# EAGLE design bms (EAGLE 4.13)
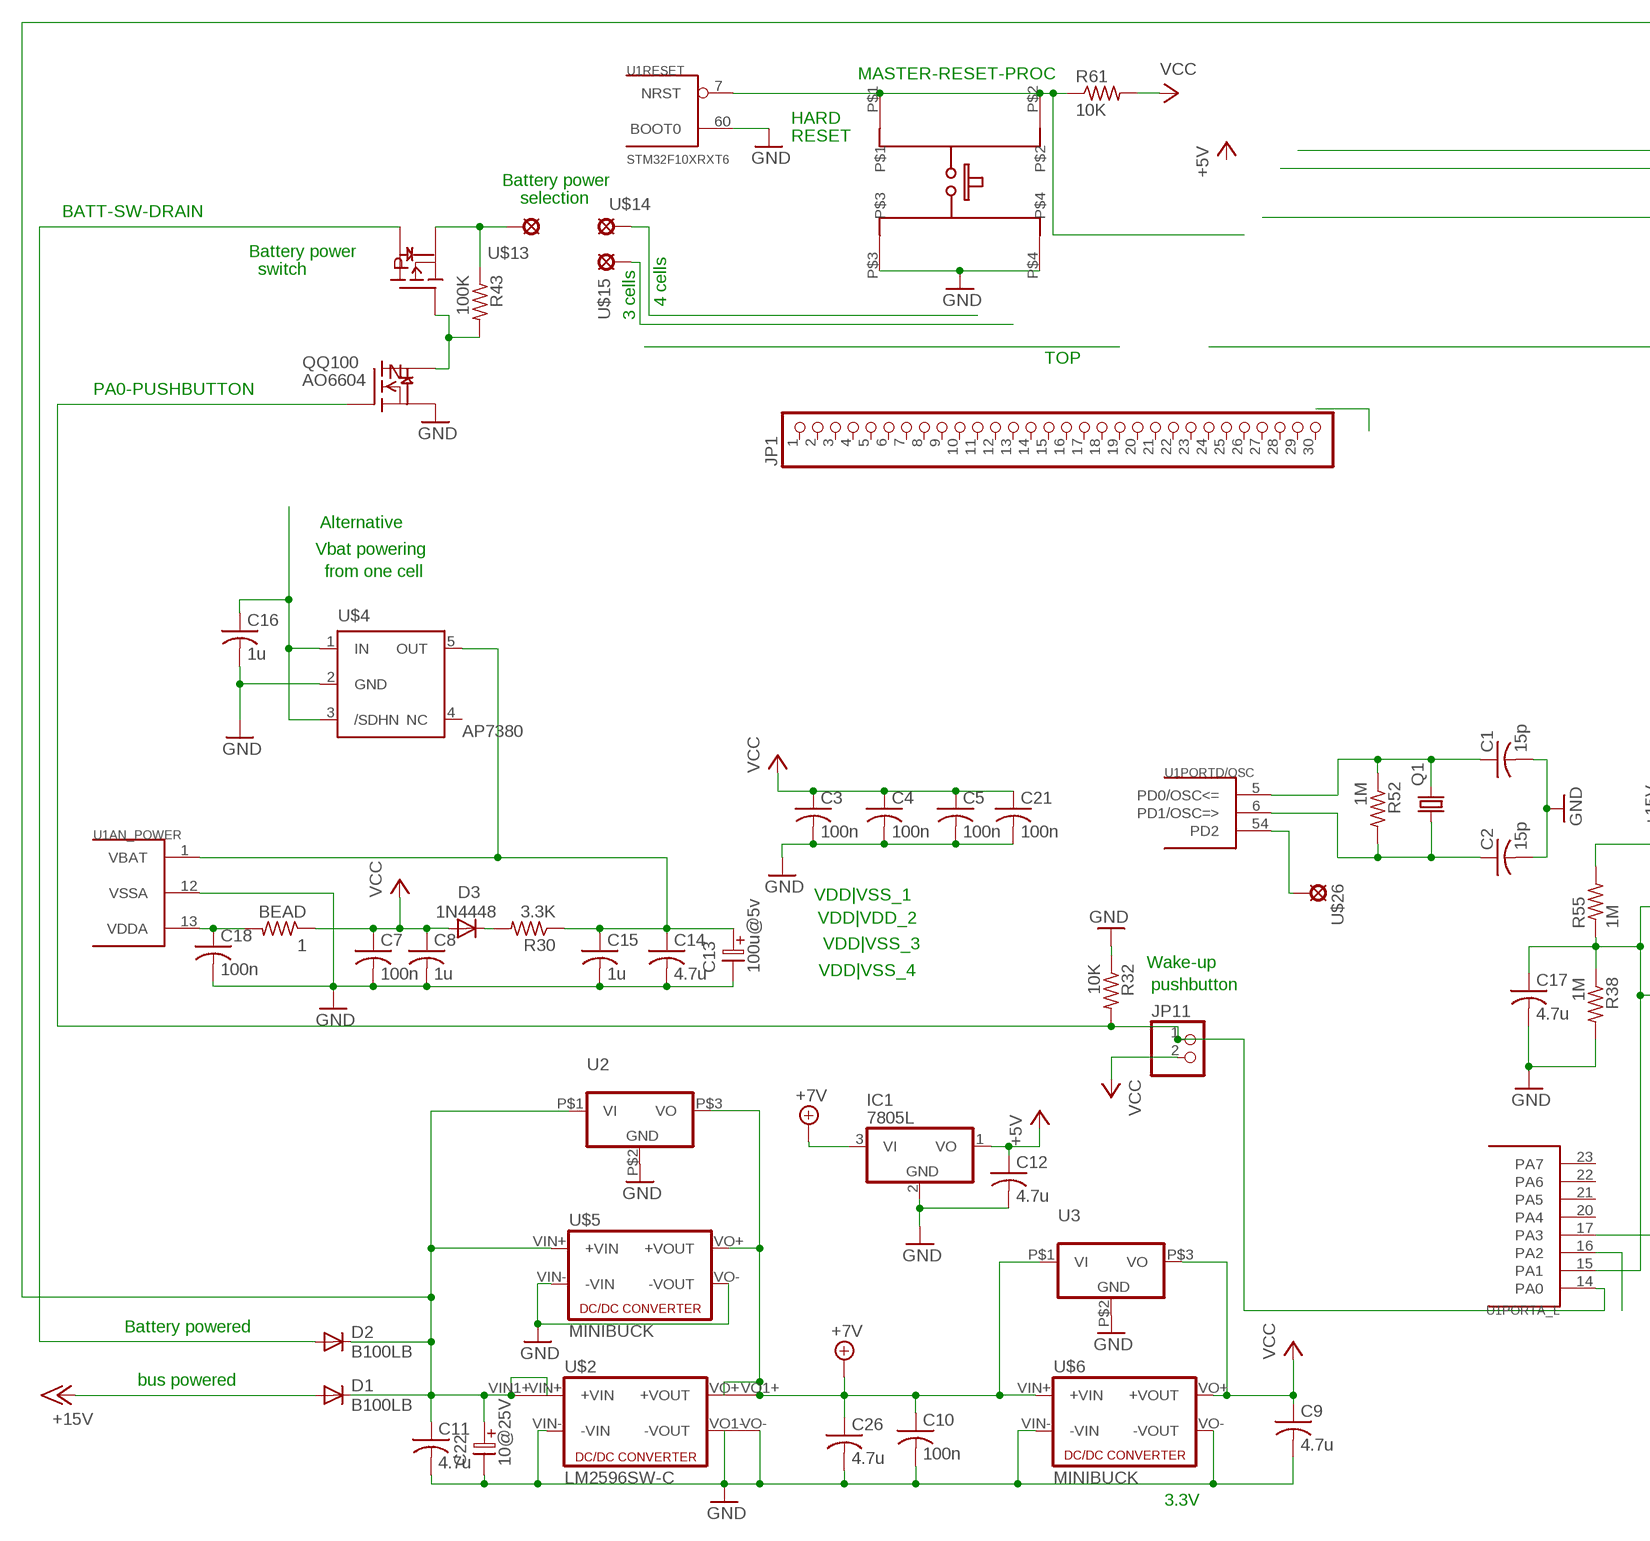
[diagram p0: schematic, sheet 1, part 1 of 2]
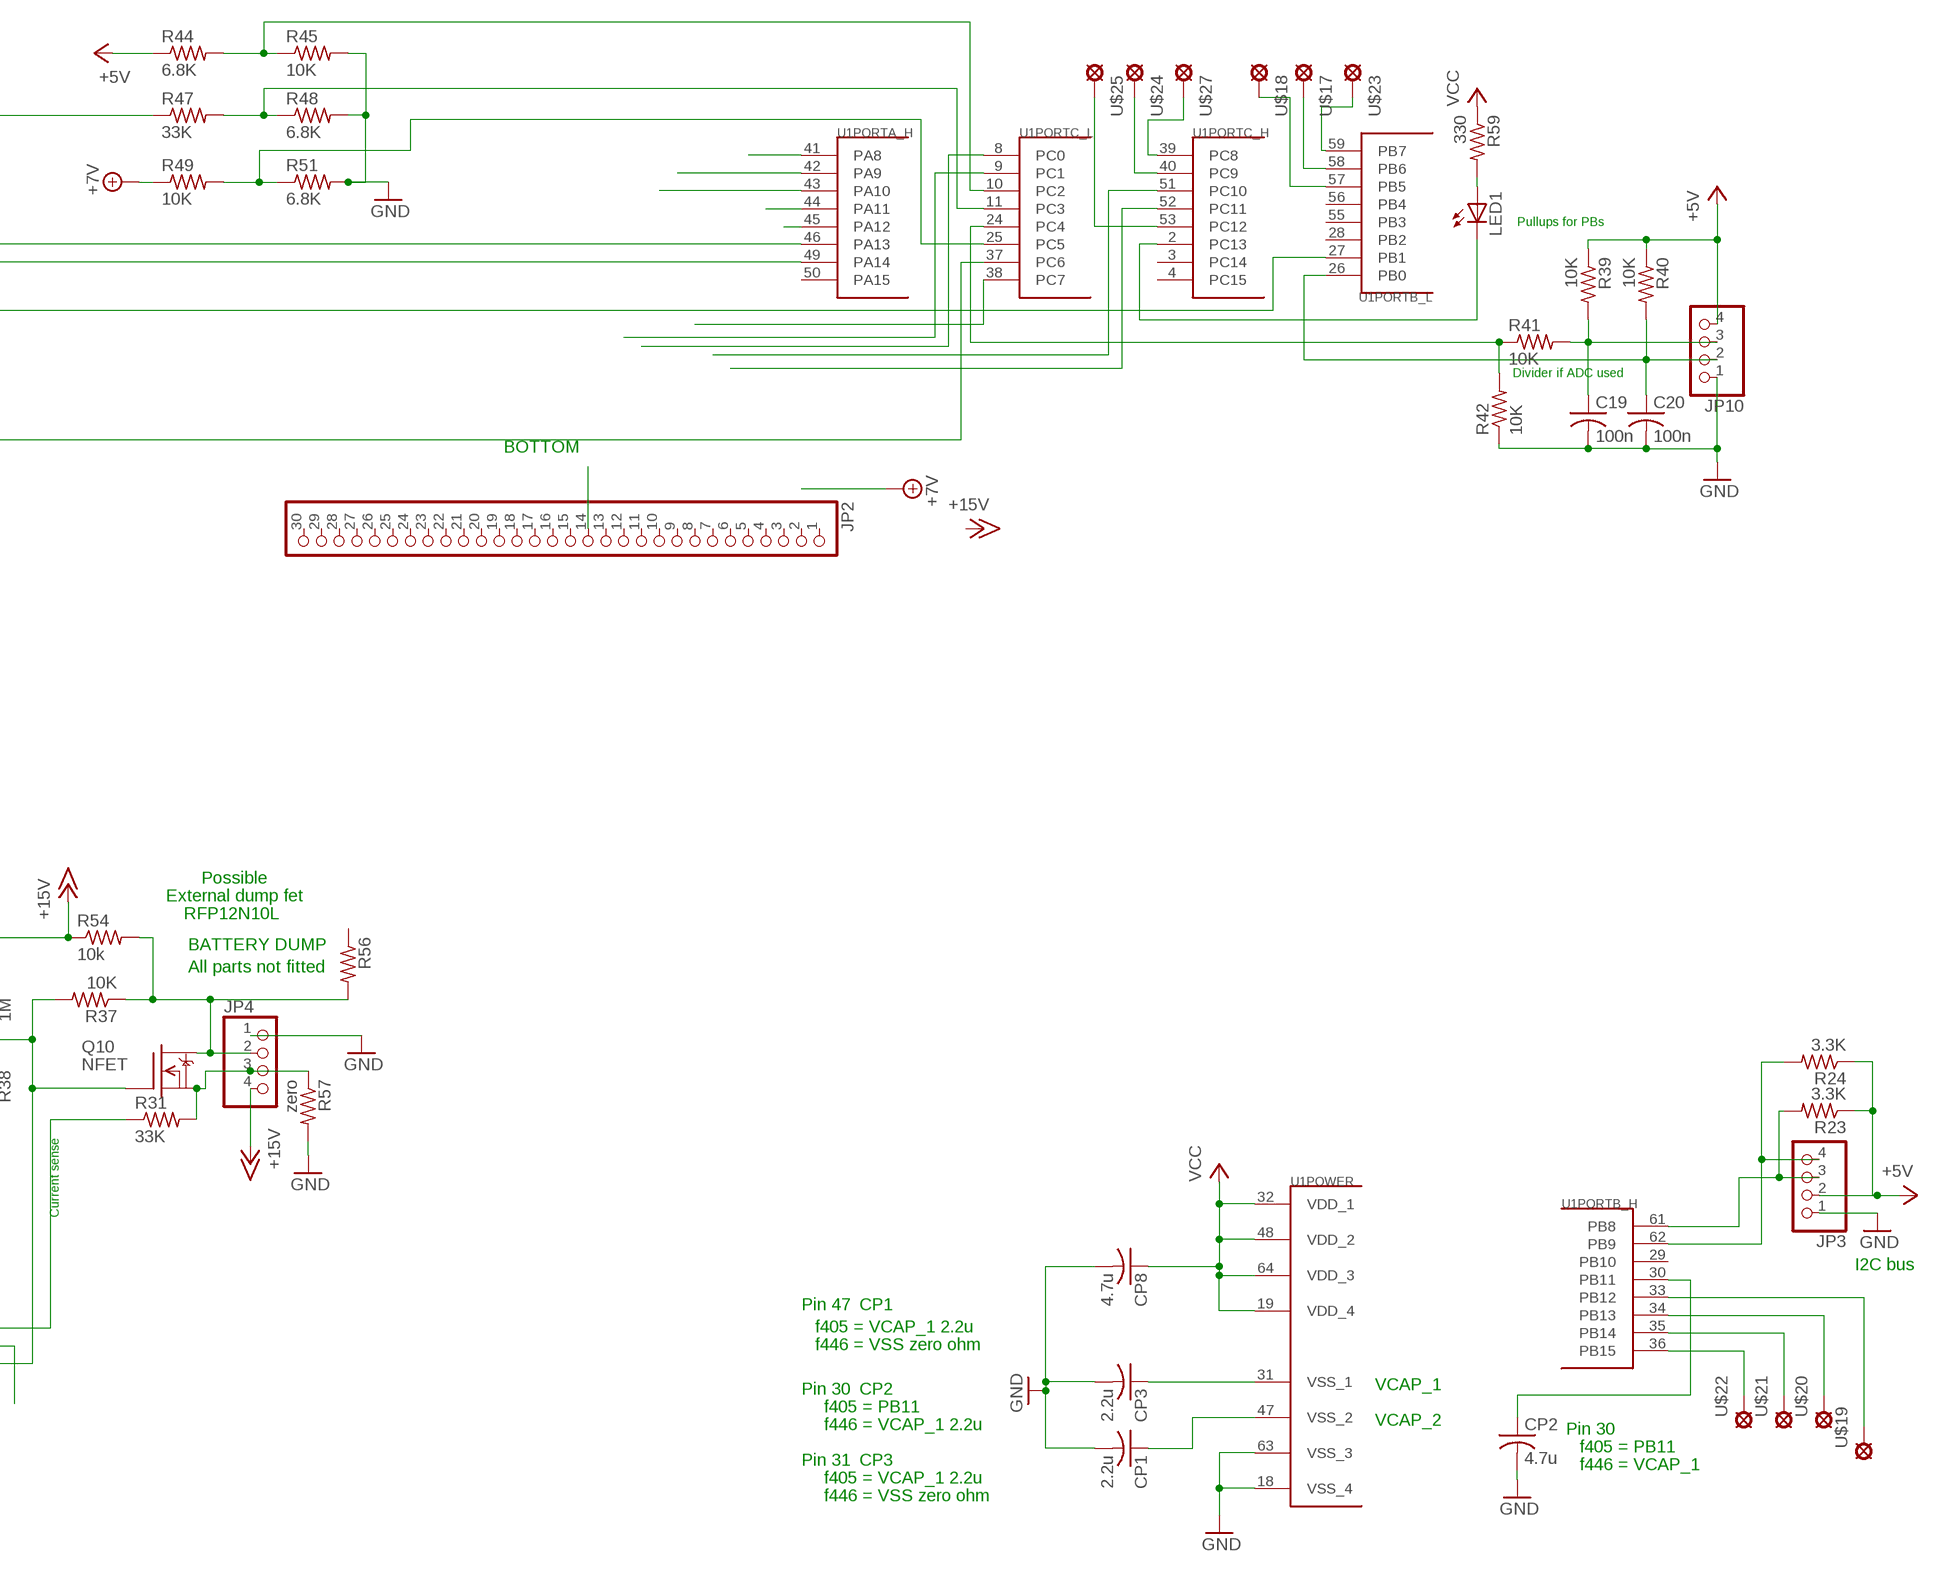
[diagram p1: schematic, sheet 1, part 2 of 2]

## Parts
BEAD  1  R-US_R0603  [R0603]
C1  15p  C-USC0603  [C0603]
C2  15p  C-USC0603  [C0603]
C3  100n  C-USC0603  [C0603]
C4  100n  C-USC0603  [C0603]
C5  100n  C-USC0603  [C0603]
C7  100n  C-USC0603  [C0603]
C8  1u  C-USC0603  [C0603]
C9  4.7u  C-USC0805  [C0805]
C10  100n  C-USC0603  [C0603]
C11  4.7u  C-USC0603  [C0603]
C12  4.7u  C-USC0805  [C0805]
C13  100u@5v  ELC-2,5L  [ES-2,5L]
C14  4.7u  C-USC0603  [C0603]
C15  1u  C-USC0603  [C0603]
C16  1u  C-USC0603  [C0603]
C17  4.7u  C-USC0603  [C0603]
C18  100n  C-USC0603  [C0603]
C19  100n  C-USC0603  [C0603]
C20  100n  C-USC0603  [C0603]
C21  100n  C-USC0603  [C0603]
C22  10@25V  ELC-2,5L  [ES-2,5L]
C26  4.7u  C-USC0603  [C0603]
CP1  2.2u  C-USC0603  [C0603]
CP2  4.7u  C-USC0603  [C0603]
CP3  2.2u  C-USC0603  [C0603]
CP8  4.7u  C-USC0603  [C0603]
D1  B100LB  [SMB_1]
D2  B100LB  [SMB_1]
D3  1N4448  DIODE-SOD123  [SOD123]
IC1  7805L  [TO92]
JP1  PINHD-1X30  [1X30]
JP2  PINHD-1X30  [1X30]
JP3  PINHD-1X4  [1X04]
JP4  PINHD-1X4  [1X04]
JP10  PINHD-1X4  [1X04]
JP11  PINHD-1X2  [1X02]
LED1  LEDCHIP-LED0603  [CHIP-LED0603]
Q1  CRYTALHC49S  [HC49/S]
Q10  NFET  DMN3404L  [SOT-23]
QQ100  AO6604  [TSOP6]
R23  3.3K  R-US_R0603  [R0603]
R24  3.3K  R-US_R0603  [R0603]
R30  3.3K  R-US_R0603  [R0603]
R31  33K  R-US_R0603  [R0603]
R32  10K  R-US_R0603  [R0603]
R37  10K  R-US_R0603  [R0603]
R38  1M  R-US_R0603  [R0603]
R39  10K  R-US_R0603  [R0603]
R40  10K  R-US_R0603  [R0603]
R41  10K  R-US_R0603  [R0603]
R42  10K  R-US_R0603  [R0603]
R43  100K  R-US_R0603  [R0603]
R44  6.8K  R-US_R0603  [R0603]
R45  10K  R-US_R0603  [R0603]
R47  33K  R-US_R0603  [R0603]
R48  6.8K  R-US_R0603  [R0603]
R49  10K  R-US_R0603  [R0603]
R51  6.8K  R-US_R0603  [R0603]
R52  1M  R-US_R0603  [R0603]
R54  10k  R-US_R0603  [R0603]
R55  1M  R-US_R0603  [R0603]
R56  R-US_0411/15  [0411/15]
R57  zero  R-US_R0603  [R0603]
R59  330  R-US_R0603  [R0603]
R61  10K  R-US_R0603  [R0603]
SW1  E-SWITCH  [E-SWITCH]
U1  STM32F10XRXT6  [TQFP64]
U2  78XXTVERT  [TO-220V1]
U3  78XXTVERT  [TO-220V1]
U$2  LM2596SW-C  [LM2596SW-C]
U$4  AP7380  MCP1811  [SOT23-5]
U$5  MINIBUCK  [MINIBUCK]
U$6  MINIBUCK  [MINIBUCK]
U$13  SOLDPAD028  [SOLPAD028]
U$14  SOLDPAD028  [SOLPAD028]
U$15  SOLDPAD028  [SOLPAD028]
U$17  SOLDPAD028  [SOLPAD028]
U$18  SOLDPAD028  [SOLPAD028]
U$19  SOLDPAD028  [SOLPAD028]
U$20  SOLDPAD028  [SOLPAD028]
U$21  SOLDPAD028  [SOLPAD028]
U$22  SOLDPAD028  [SOLPAD028]
U$23  SOLDPAD028  [SOLPAD028]
U$24  SOLDPAD028  [SOLPAD028]
U$25  SOLDPAD028  [SOLPAD028]
U$26  SOLDPAD028  [SOLPAD028]
U$27  SOLDPAD028  [SOLPAD028]

## Nets
15V-DIOIDE-ORED: C11.1 C22.1 D1.C D2.C R47.1 U2.P$1(VI) U$2.VIN1+(+VIN1) U$2.VIN+(+VIN) U$5.VIN+(+VIN)
+5V: C12.1 IC1.1(VO) JP3.2 JP10.4 R23.1 R24.1 R39.1 R40.1 R44.1
+7V: C10.1 C26.1 IC1.3(VI) R49.1 U2.P$3(VO) U3.P$1(VI) U$2.VO1+(+VOUT1) U$2.VO+(+VOUT) U$5.VO+(+VOUT) U$6.VIN+(+VIN)
+15V: D1.A JP4.4 R54.1 R55.2
BATT-SELECT: QQ100.P$2(S2) R43.1 U$13.MP
BATT-SW-DRAIN: D2.A QQ100.P$4(D2)
CL1: C16.1 U$4.1(IN) U$4.3(/SDHN)
CL3: U$15.MP
CL4: U$14.MP
DUAL-FET-BATT-SWITCH: QQ100.P$3(G2) QQ100.P$6(D1) R43.2
DUMPFETSOURCE: JP4.3 Q10.2(S) R31.2 R57.1
GND: C1.2 C2.2 C3.2 C4.2 C5.2 C7.2 C8.2 C9.2 C10.2 C11.2 C12.2 C13.2 C14.2 C15.2 C16.2 C17.2 C18.2 C19.2 C20.2 C21.2 C22.2 C26.2 CP1.2 CP2.2 CP3.2 CP8.2 IC1.2(GND) JP3.1 JP4.1 JP10.1 QQ100.P$5(S1) R32.1 R38.2 R42.1 R45.2 R48.2 R51.2 R57.2 SW1.P$3 SW1.P$4 U1.12(AN_POWER:VSSA) U1.18(POWER:VSS_4) U1.60(RESET:BOOT0) U1.63(POWER:VSS_3) U2.P$2(GND) U3.P$2(GND) U$2.VIN-(-VIN) U$2.VO1-(-VOUT) U$2.VO-(-VOUT1) U$4.2(GND) U$5.VIN-(-VIN) U$5.VO-(-VOUT) U$6.VIN-(-VIN) U$6.VO-(-VOUT)
JP12-FETDRAIN-RC: JP4.2 Q10.3(D) R37.1 R54.2 R56.2
JTCK: U1.49(PORTA_H:PA14)
JTMS: U1.46(PORTA_H:PA13)
LED1-A: LED1.A R59.2
N$1: U1.37(PORTC_L:PC6)
NRST: R61.1 SW1.P$1 SW1.P$2 U1.7(RESET:NRST)
PA0-PUSHBUTTON: JP11.1 QQ100.P$1(G1) R32.2 U1.14(PORTA_L:PA0)
PA1-DUMPFETGATE: C17.1 Q10.1(G) R37.2 R38.1 R55.1 U1.15(PORTA_L:PA1)
PA2|WDT: U1.16(PORTA_L:PA2)
PA3-DUMP-CURRENT: R31.1 U1.17(PORTA_L:PA3)
PA8-T1CH1-FANGATE: U1.41(PORTA_H:PA8)
PA9-USART1-TX: U1.42(PORTA_H:PA9)
PA10-USART1-RX: U1.43(PORTA_H:PA10)
PA11_CANRXD: U1.44(PORTA_H:PA11)
PA12_CANTX: U1.45(PORTA_H:PA12)
PB0: C20.1 JP10.2 R40.2 U1.26(PORTB_L:PB0)
PB1-T3C4-FANTACH: U1.27(PORTB_L:PB1)
PB5-CAN2-RX: U1.57(PORTB_L:PB5) U$18.MP
PB6-CAN2-TX: U1.58(PORTB_L:PB6) U$17.MP
PB7: U1.59(PORTB_L:PB7) U$23.MP
PB8-I2C2-SDA: JP3.3 R23.2 U1.61(PORTB_H:PB8)
PB9-I2C1-SCL: JP3.4 R24.2 U1.62(PORTB_H:PB9)
PB11-I2C2-SDA|VCAP1: CP2.1 U1.30(PORTB_H:PB11)
PB12-SPI2-NSS: U1.33(PORTB_H:PB12) U$19.MP
PB14-SPI2-MISO: U1.35(PORTB_H:PB14) U$21.MP
PB-13-SPI2-SCK: U1.34(PORTB_H:PB13) U$20.MP
PB-15-SPI2-MOSI: U1.36(PORTB_H:PB15) U$22.MP
PC0-15VDIVIDED-IN10: U1.8(PORTC_L:PC0)
PC1-BATDIVIDED-IN11: U1.9(PORTC_L:PC1)
PC2-IN12-5V-DIVIDED: R44.2 R45.1 U1.10(PORTC_L:PC2)
PC3-15V-OR-DIVIDED-IN13: R47.2 R48.1 U1.11(PORTC_L:PC3)
PC4-HEADER: C19.1 JP10.3 R39.2 R41.2
PC4-IN14: R41.1 R42.2 U1.24(PORTC_L:PC4)
PC5-7VDIVIDED-IN15: R49.2 R51.1 U1.25(PORTC_L:PC5)
PC7-T3C2-MCP1416-INPUT: U1.38(PORTC_L:PC7)
PC8-SDIO_D0: U1.39(PORTC_H:PC8) U$27.MP
PC9-SDIO_D1: U1.40(PORTC_H:PC9) U$24.MP
PC10-LED2: U1.51(PORTC_H:PC10)
PC11-LED1: U1.52(PORTC_H:PC11)
PC12-SDIO_CK|I2C2-SDA: U1.53(PORTC_H:PC12) U$25.MP
PC13-LED1: LED1.C U1.2(PORTC_H:PC13)
PD0_OSC_IN_XTAL: C1.1 Q1.2 R52.1 U1.5(PORTD/OSC:PD0/OSC<=)
PD1_OSC_OUT: C2.1 Q1.1 R52.2 U1.6(PORTD/OSC:PD1/OSC=>)
PD2-SDIO_CMD: U1.54(PORTD/OSC:PD2) U$26.MP
S18: JP2.14
VBAT: C13.1 C14.1 C15.1 R30.1 U1.1(AN_POWER:VBAT) U$4.5(OUT)
VBAT-DIODE-RES: D3.C R30.2
VCC: BEAD.1 C3.1 C4.1 C5.1 C7.1 C8.1 C9.1 C21.1 CP8.1 D3.A JP11.2 R59.1 R61.2 U1.19(POWER:VDD_4) U1.32(POWER:VDD_1) U1.48(POWER:VDD_2) U1.64(POWER:VDD_3) U3.P$3(VO) U$6.VO+(+VOUT)
VDDA: BEAD.2 C18.1 U1.13(AN_POWER:VDDA)
VSS_1-VCAP_1: CP3.1 U1.31(POWER:VSS_1)
VSS_2: CP1.1 U1.47(POWER:VSS_2)
Unconnected: JP1.1 JP1.2 JP1.3 JP1.4 JP1.5 JP1.6 JP1.7 JP1.8 JP1.9 JP1.10 JP1.11 JP1.12 JP1.13 JP1.14 JP1.15 JP1.16 JP1.17 JP1.18 JP1.19 JP1.20 JP1.21 JP1.22 JP1.23 JP1.24 JP1.25 JP1.26 JP1.27 JP1.28 JP1.29 JP1.30 JP2.1 JP2.2 JP2.3 JP2.4 JP2.5 JP2.6 JP2.7 JP2.8 JP2.9 JP2.10 JP2.11 JP2.12 JP2.13 JP2.15 JP2.16 JP2.17 JP2.18 JP2.19 JP2.20 JP2.21 JP2.22 JP2.23 JP2.24 JP2.25 JP2.26 JP2.27 JP2.28 JP2.29 JP2.30 R56.1 U1.3(PORTC_H:PC14) U1.4(PORTC_H:PC15) U1.20(PORTA_L:PA4) U1.21(PORTA_L:PA5) U1.22(PORTA_L:PA6) U1.23(PORTA_L:PA7) U1.28(PORTB_L:PB2) U1.29(PORTB_H:PB10) U1.50(PORTA_H:PA15) U1.55(PORTB_L:PB3) U1.56(PORTB_L:PB4) U$4.4(NC)

## Notes on the sheet
- MASTER-RESET-PROC
- HARD
- Pullups for PBs
- RESET
- Battery power
- selection
- BATT-SW-DRAIN
- Battery power
- switch
- Divider if ADC used
- 4 cells
- 3 cells
- TOP | BOTTOM
- PA0-PUSHBUTTON
- Alternative
- Vbat powering
- from one cell
- Possible
- External dump fet
- RFP12N10L
- BATTERY DUMP
- All parts not fitted
- VDD|VSS_1
- VDD|VDD_2
- VDD|VSS_3
- VDD|VSS_4 | Wake-up
- pushbutton
- Current sense
- I2C bus
- Pin 47 | CP1
- f405 = VCAP_1 2.2u
- f446 = VSS zero ohm
- Pin 30 | CP2 | VCAP_1
- f405 = PB11
- Battery powered | f446 = VCAP_1 2.2u | VCAP_2
- Pin 30
- f405 = PB11
- Pin 31 | CP3 | f446 = VCAP_1
- bus powered | f405 = VCAP_1 2.2u
- f446 = VSS zero ohm
- 3.3V

## Library data of the parts
BEAD R23 R24 R30-R32 R37-R45 R47-R49 R51 R52 R54-R57 R59 R61 = rcl:R-US_: RESISTOR, American symbol
C1-C5 C7-C12 C14-C21 C26 CP1-CP3 CP8 = rcl:C-US: CAPACITOR, American symbol
C13 C22 = DEH:ELC-2,5L
D1 D2 = diode-1:B100LB
D3 = diode:DIODE-: DIODE
IC1 = linear:78*: Positive VOLTAGE REGULATOR
JP1 JP2 = pinhead:PINHD-1X30: PIN HEADER
JP3 JP4 JP10 = pinhead:PINHD-1X4: PIN HEADER
JP11 = pinhead:PINHD-1X2: PIN HEADER
LED1 = led:LED: LED OSRAM: - CHIPLED LG R971, LG N971, LY N971, LG Q971, LY Q971, LO R971, LY R971 LH N974, LH R974 LS Q976, LO Q976, LY Q976 LO Q996 - Hyper CHIPLED LW Q18S LB Q993, LB Q99A, LB R99A - SideLED LS A670, LO A670, LY A670, LG A670, LP A670 LB A673, LV A673, LT A673, LW A673 LH A674 LY A675 LS A676, LA A676, LO A676, LY A676, LW A676 LS A679, LY A679, LG A679 - Hyper Micro SIDELED® LS Y876, LA Y876, LO Y876, LY Y876 LT Y87S - SmartLED LW L88C, LW L88S LB L89C, LB L89S, LG L890 LS L89K, LO L89K, LY L89K LS L896, LA L896, LO L896, LY L896 - TOPLED LS T670, LO T670, LY T670, LG T670, LP T670 LSG T670, LSP T670, LSY T670, LOP T670, LYG T670 LG T671, LOG T671, LSG T671 LB T673, LV T673, LT T673, LW T673 LH T674 LS T676, LA T676, LO T676, LY T676, LB T676, LH T676, LSB T676, LW T676 LB T67C, LV T67C, LT T67C, LS T67K, LO T67K, LY T67K, LW E67C LS E67B, LA E67B, LO E67B, LY E67B, LB E67C, LV E67C, LT E67C LW T67C LS T679, LY T679, LG T679 LS T770, LO T770, LY T770, LG T770, LP T770 LB T773, LV T773, LT T773, LW T773 LH T774 LS E675, LA E675, LY E675, LS T675 LS T776, LA T776, LO T776, LY T776, LB T776 LHGB T686 LT T68C, LB T68C - Hyper Mini TOPLED® LB M676 - Mini TOPLED Santana® LG M470 LS M47K, LO M47K, LY M47K Source: http://www.osram.convergy.de/
Q1 = crystal:CRYTAL: CRYSTAL
Q10 = transistor-fet:DMN3404L
QQ100 = transistor-fet:AO6604
SW1 = switch-misc:E-SWITCH
U1 = stm32:STM32F10XRXT6: STM32F101/103 64pin LQFP
U2 U3 = DEH:78XXTVERT
U$2 = dc-dc-converter:LM2596SW-C
U$4 = v-reg-2:MCP1811
U$5 U$6 = dc-dc-converter:MINIBUCK
U$13-U$15 U$17-U$27 = solpad:SOLDPAD028

## Board
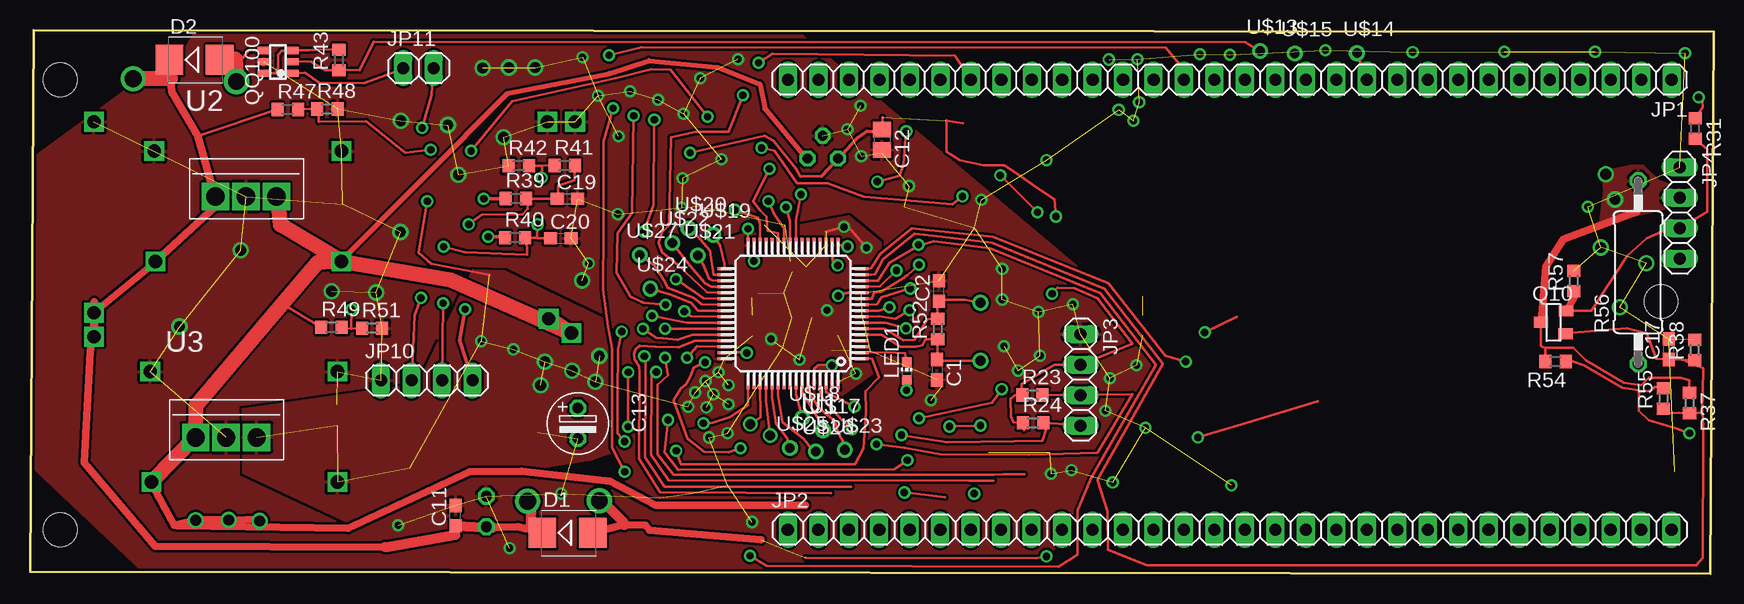
[diagram p2: board, top side]
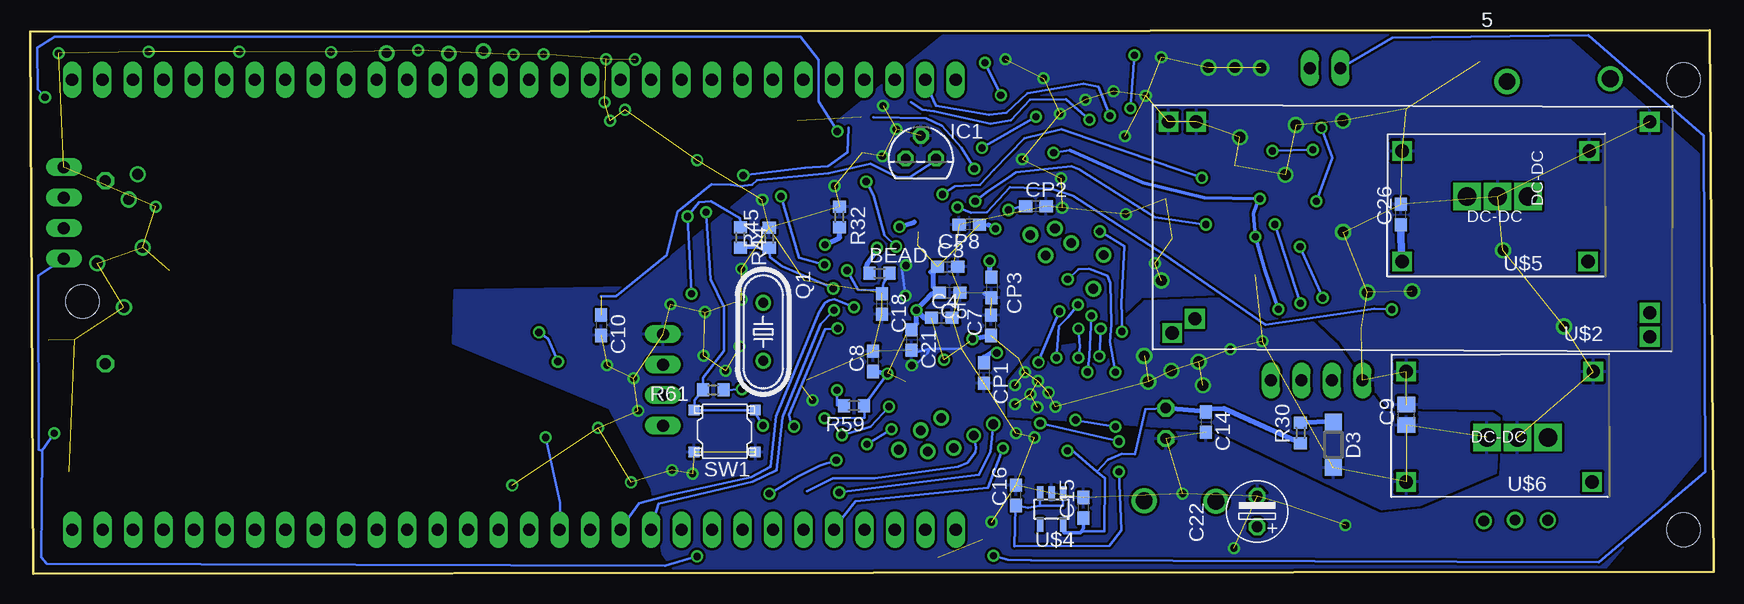
[diagram p3: board, bottom side, seen from below]

Size 140.34 x 45.31 mm. Coordinates in mm from the lower left corner, seen from the top.
Outline: 0,0.18 0.31,45.31 140.34,45.17 140.06,0 0,0.18
Copper layers (1*16): Top 0.035mm / dielectric 1.5mm / Bottom 0.035mm
Design rules "default": minimum track width 8mil, minimum drill 0.6mm, track to track 0.2083mm, track to pad 8mil, pad to pad 8mil, via to via 8mil, smd to smd 0mil, copper to edge 8mil, drill to drill 8mil, minimum pad ring 10mil, minimum via ring 8mil, stop-mask expansion 4mil, vias tented up to drill 0mil, thermal gap 10mil
Holes 2.8 mm at 135.96,22.68 2.51,41.16 2.51,3.67

### Footprints (pad centres in the part's own frame; a part is rotated, then mirrored left to right if it is on the bottom)
R0603 = smd 1 x 1.1: 1 -0.85,0; 2 0.85,0
C0603 = smd 1.1 x 1: 1 -0.85,0; 2 0.85,0
C0805 = smd 1.3 x 1.5: 1 -0.85,0; 2 0.85,0
ES-2,5L = drill 0.889 pad 1.27 octagon: 1 0,0; 2 2.54,0
SMB_1 = smd 2.3 x 2.5: A 1.9,0; C -2.3,0
SOD123 = smd 1.4 x 1.4: A 1.9,0; C -1.9,0
TO92 = drill 0.813 octagon: 1 -1.27,0; 2 0,1.905; 3 1.27,0
1X30 = drill 1.016 long: 1 -36.83,0; 2 -34.29,0; 3 -31.75,0; 4 -29.21,0; 5 -26.67,0; 6 -24.13,0; 7 -21.59,0; 8 -19.05,0; 9 -16.51,0; 10 -13.97,0; 11 -11.43,0; 12 -8.89,0; 13 -6.35,0; 14 -3.81,0; 15 -1.27,0; 16 1.27,0; 17 3.81,0; 18 6.35,0; 19 8.89,0; 20 11.43,0; 21 13.97,0; 22 16.51,0; 23 19.05,0; 24 21.59,0; 25 24.13,0; 26 26.67,0; 27 29.21,0; 28 31.75,0; 29 34.29,0; 30 36.83,0
1X04 = drill 1 long: 1 -3.81,0; 2 -1.27,0; 3 1.27,0; 4 3.81,0
1X02 = drill 1 long: 1 -1.27,0; 2 1.27,0
CHIP-LED0603 = smd 0.8 x 0.8: A 0,-0.75; C 0,0.75
HC49/S = drill 0.813 round: 1 -2.413,0; 2 2.413,0
SOT-23 = smd 0.9 x 1.2: 1 -1,-1.006; 2 0.9,-1.056; 3 -0.05,1.056
TSOP6 = smd 0.6 x 1: P$1 -0.95,-1.2; P$2 0,-1.2; P$3 0.95,-1.2; P$4 0.95,1.2; P$5 0,1.2; P$6 -0.95,1.2
0411/15 = drill 0.914 octagon: 1 -7.62,0; 2 7.62,0
E-SWITCH = smd 0.9 x 0.9: P$1 -2.55,1.75; P$2 2.55,1.75; P$3 -2.55,-1.75; P$4 2.55,-1.75
TQFP64 = smd 1.2 x 0.26: 1 -5.7,3.75; 2 -5.7,3.25; 3 -5.7,2.75; 4 -5.7,2.25; 5 -5.7,1.75; 6 -5.7,1.25; 7 -5.7,0.75; 8 -5.7,0.25; 9 -5.7,-0.25; 10 -5.7,-0.75; 11 -5.7,-1.25; 12 -5.7,-1.75; 13 -5.7,-2.25; 14 -5.7,-2.75; 15 -5.7,-3.25; 16 -5.7,-3.75; 33 5.7,-3.75; 34 5.7,-3.25; 35 5.7,-2.75; 36 5.7,-2.25; 37 5.7,-1.75; 38 5.7,-1.25; 39 5.7,-0.75; 40 5.7,-0.25; 41 5.7,0.25; 42 5.7,0.75; 43 5.7,1.25; 44 5.7,1.75; 45 5.7,2.25; 46 5.7,2.75; 47 5.7,3.25; 48 5.7,3.75 | smd 0.26 x 1.2: 17 -3.75,-5.7; 18 -3.25,-5.7; 19 -2.75,-5.7; 20 -2.25,-5.7; 21 -1.75,-5.7; 22 -1.25,-5.7; 23 -0.75,-5.7; 24 -0.25,-5.7; 25 0.25,-5.7; 26 0.75,-5.7; 27 1.25,-5.7; 28 1.75,-5.7; 29 2.25,-5.7; 30 2.75,-5.7; 31 3.25,-5.7; 32 3.75,-5.7; 49 3.75,5.7; 50 3.25,5.7; 51 2.75,5.7; 52 2.25,5.7; 53 1.75,5.7; 54 1.25,5.7; 55 0.75,5.7; 56 0.25,5.7; 57 -0.25,5.7; 58 -0.75,5.7; 59 -1.25,5.7; 60 -1.75,5.7; 61 -2.25,5.7; 62 -2.75,5.7; 63 -3.25,5.7; 64 -3.75,5.7
TO-220V1 = drill 1.524 pad 2.184 square: P$1 -2.54,-1.905; P$2 0,-1.905; P$3 2.54,-1.905
LM2596SW-C = drill 1.1 square: VIN1+ -19,9.7; VIN+ -19,7.7; VIN- -19,-8.2; VO1+ 20.8,9.4; VO1- 21.1,-8.2; VO+ 18.9,8.2; VO- 18.8,-8.2
SOT23-5 = smd 0.55 x 1.2: 1 -0.95,-1.3; 2 0,-1.3; 3 0.95,-1.3; 4 0.95,1.3; 5 -0.95,1.3
MINIBUCK = drill 1.1 square: VIN+ -7.7,4.6; VIN- -7.8,-4.6; VO+ 7.8,4.6; VO- 7.8,-4.6
SOLPAD028 = drill 0.8 pad 1.1 round: MP 0,0

### Placement (x,y rotation side)
BEAD  69.53,25.03 0 bottom
C1  75.6,17 270 top
C2  75.77,23.56 90 top
C3  63.85,25.57 0 bottom
C4  64.33,21.33 0 bottom
C5  63.68,23.42 0 bottom
C7  60.22,20.7 90 bottom
C8  70.05,17.7 90 bottom
C9  25.6,13.24 90 bottom
C10  92.73,20.71 270 bottom
C11  35.47,4.84 90 top
C12  71.02,36.17 270 top
C13  45.66,13.8 270 top
C14  42.33,12.63 270 bottom
C15  52.52,5.5 90 bottom
C16  58.15,6.53 90 bottom
C17  136.62,18.71 90 top
C18  69.34,22.47 270 bottom
C19  44.8,31.25 0 top
C20  44.25,27.96 0 top
C21  66.85,19.48 270 bottom
C22  38.04,3.91 90 bottom
C26  26.06,29.93 90 bottom
CP1  60.83,16.73 270 bottom
CP2  56.49,30.63 0 bottom
CP3  60.18,23.86 270 bottom
CP8  62.04,29.1 180 bottom
D1  45.01,3.4 0 top
D2  13.91,42.83 0 top
D3  31.69,10.75 270 bottom
IC1  66.08,34.6 0 bottom
JP1  100.01,41.17 180 top
JP2  100,3.67 0 top
JP3  87.58,16.16 270 top
JP4  137.52,30.07 270 top
JP10  33.08,16.11 0 top
JP11  32.38,42.14 0 top
LED1  73.07,16.88 0 top
Q1  79.22,20.16 270 bottom
Q10  126.99,21 90 top
QQ100  20.68,42.66 90 top
R23  83.56,14.89 0 top
R24  83.61,12.57 0 top
R30  34.44,11.74 90 bottom
R31  138.81,37.1 270 top
R32  72.87,29.74 270 bottom
R37  138.33,14.23 270 top
R38  138.76,18.66 90 top
R39  40.51,31.27 0 top
R40  40.44,28.01 0 top
R41  44.57,34.02 0 top
R42  40.74,34 0 top
R43  25.75,42.8 90 top
R44  81.12,28.02 270 bottom
R45  78.72,28 90 bottom
R47  21.49,38.69 0 top
R48  24.78,38.73 0 top
R49  25.14,20.54 0 top
R51  28.52,20.46 0 top
R52  75.67,20.39 90 top
R54  127.15,17.68 180 top
R55  136.15,14.59 90 top
R56  134.05,25.12 90 top
R57  128.68,24.4 90 top
R59  71.65,14 180 bottom
R61  83.38,15.32 0 bottom
SW1  82.43,11.89 0 bottom
U1  63.61,21.68 180 top
U2  18,33.34 0 top
U3  16.35,13.26 0 top
U$2  24.33,29.46 180 bottom
U$4  55.18,5.39 180 bottom
U$5  18.16,30.62 180 bottom
U$6  17.83,12.25 180 bottom
U$13  102.54,43.56 0 top
U$14  110.61,43.38 0 top
U$15  105.43,43.36 0 top
U$17  66.1,11.95 0 top
U$18  64.38,12.98 0 top
U$19  56.95,28.24 0 top
U$20  54.9,28.77 0 top
U$21  55.67,26.51 0 top
U$22  53.54,27.57 0 top
U$23  67.92,10.33 0 top
U$24  51.7,23.75 0 top
U$25  63.35,10.48 0 top
U$26  65.5,10.19 0 top
U$27  50.84,26.57 0 top

### Tracks (layer width: path | path; a pad name or v marks a point on that pad's centre or on a via)
15V-DIOIDE-ORED  (via drill 1.4)
  Top 0.203: 39.19,3.88 39.19,3.86 C22.1 | D1.C 41.91,3.99 40.64,3.99 40.64,3.9 | 13.99,36.48 14.06,36.49 R47.1
  Top 0.406: v41.48,6.05 v41.48,6.04 41.82,6.01
  Top 0.61: U2.P$1 15.45,31.54 | U2.P$1 | U2.P$1 15.45,30.58 15.42,30.58 U$5.VIN+ 10.37,25.89 U$2.VIN+ 5.35,22.65 U$2.VIN1+ 5.39,20.76 5.04,18.54 4.51,9.24 10.42,2.27 29.6,2.21 | U2.P$1 15.42,31.43 | 41.33,3.74 40.69,3.9 40.64,3.9 39.19,3.88 38.69,3.87 | D1.C 41.73,3.75 | D2.C 11.72,41.27 11.8,40.18 13.99,36.48 15.43,31.39 U2.P$1
  Top 0.813: 29.6,2.21 35.44,3.24 35.47,3.95 C11.1 38.6,3.85 C22.1 | 41.73,3.75 41.76,3.88 41.82,6.01
  Top 1.27: 11.72,41.27 11.41,41.25 v8.6,41.25
+5V  (via drill 0.6)  (1 unrouted)
  Top 0.203: 77.79,37.56 76.38,37.76 76.38,37.78 76.4,35.16 77.5,34.47 79.48,34.04 81.23,34.05 82.63,33.08 83.5,32.47 84.43,31.84 85.41,31.19 v85.52,29.77 | 70.99,36.85 C12.1 71.06,38.02 | 65.98,33.12 64.23,33.12 64.23,33.1 63.85,33.75 61.98,36.07 61.21,36.51 v55.01,35.09 | 67.11,34.33 IC1.1 67.64,34.89 | 39.72,31.23 R39.1 | 39.53,28.07 R40.1 | 82.84,11.96 R24.1 81.97,12.63 81.77,13.11 81.74,14.59 82.11,14.88 82.67,14.92 R23.1 82.72,14.76 82.64,15.79 85.38,17.43 JP3.2 91.89,19.18 88.97,22.97 87.07,23.78 85.66,23.82 85.21,23.43 v85.2,23.33
  Top 0.305: 70.99,36.85 69.78,36.86 68.93,36.29 67.64,34.89 | 65.98,33.12 67.11,34.33 | v37.83,31.26 39.72,31.23 | JP10.4 35.8,19.44 v36.28,22.04 | 38.17,28.07 v38.2,28.07 39.53,28.07
  Bottom 0.203: 53.66,35.28 v55.01,35.09 | v85.2,23.33 v85.52,29.77 84.55,30.97 83.58,31.03 81.16,29.63 81.09,28.82 R44.1
  Bottom 0.305: 53.66,35.28 47.55,32.57 42.46,31.32 v37.83,31.26 37.89,31.27 38.37,29.98 v38.2,28.07 37.42,25.31 v36.28,22.04
+7V  (via drill 0.9)  (1 unrouted)
  Top 0.203: U2.P$3 20.58,31.42 20.65,31.43 | 21.03,22.5 | 21.03,22.5 R49.1
  Top 0.406: U$5.VO+ 25.79,25.9 39.8,40.02 48.25,41.68 51.59,42.75 57.3,42.2 60.84,40.8 61.26,38.74 64.83,34.44 IC1.3
  Top 0.61: U$5.VO+ 25.72,25.84 | 64.66,5.72 52.16,5.69 48.35,7.72 40.99,8.54 36.64,8.51 26.52,3.77 12.26,4.02 | 12.26,4.02 12.03,4.02 10.04,7.71 U$6.VIN+ | 12.26,4.02 12.26,4.08 v13.82,4.46 13.8,4.56 v16.55,4.48 16.41,4.45 19.34,4.53 v19.15,4.39
  Top 1.27: U$6.VIN+ 13.89,11.51 U3.P$1 13.84,14.06 21.03,22.5 23.97,25.95 26,26.09 U$5.VO+ | U$5.VO+ 20.89,29.08 20.65,31.43 20.65,31.45 | U$2.VO+ 43.02,21.47 U$2.VO1+ 35.08,24.48 U$5.VO+
  Bottom 0.203: 92.74,23.13 91.5,23.13 87.28,26.53 86.37,30.17 83.52,32.45 81.92,32.4 81.14,32.28 80.17,32.41 79.72,32.8 73.77,33.38 70.29,34.18 68.01,33.06 66.96,33.07 64.8,34.46 IC1.3
  Bottom 0.61: U$5.VO+ 26.01,26.04 C26.1
+15V  (via drill 0.6, 1.4)  (1 unrouted)
  Top 0.203: 64.64,1.32 83.87,1.3 v84.74,1.44 | v138.33,11.7 137.17,12.11 134.93,12.78 134.09,13.6 134.11,15.27 | 134.11,15.27 132.74,15.5 129.51,17.39 128.58,17.7 R54.1 | 134.11,15.27 134.29,15.26 135.03,15.2 135.49,15.59 136.15,15.49 R55.2 135.89,15.42
  Top 0.406: v47.46,6.08 v47.47,6.08 47.81,5.97
  Top 0.61: 60.94,2.85 51.65,3.61 51.32,4.02 49.55,4.07 49.49,4.07 D1.A
  Top 0.813: 49.55,4.07 49.55,4.19 47.81,5.97
  Bottom 0.203: v84.74,1.44 87.39,0.65 138.94,0.82 139.4,1.39 139.31,10.24 | 139.31,10.24 139.31,10.27 v138.33,11.7 | JP4.4 139.66,24.82 139.63,10.33 139.31,10.24
BATT-SELECT
  Top 0.203: U$13.MP 101.31,44.27 28.65,44.32 27.46,41.96 25.71,41.98 R43.1 24.6,41.94 23.42,42.68 21.97,42.71 QQ100.P$2
BATT-SW-DRAIN  (via drill 1.4)
  Top 0.203: D2.A 17.12,42.89 17.69,42.91 18.24,43.64 19.41,43.64 QQ100.P$4
  Top 1.27: 17.12,42.89 17.12,42.9 v17.21,41.02
CL1  (via drill 0.6)
  Top 0.203: 96.23,41.94 94.67,43.84 50.98,43.87 v48.27,43.2 | v48.6,38.8 47.82,36.04 47.81,28.75 47.79,23.65 48.18,20.59 48.53,18.8 48.53,10.48 v49.58,8.51
  Bottom 0.203: U$4.1 54.22,5.66 56.15,5.65 | U$4.3 56.15,5.65 | 56.15,5.65 57.14,5.51 58.19,5.69 C16.1 58.2,5.58 58.27,2.29 50.36,2.32 49.38,3.64 v49.58,8.51 | v48.6,38.8 v48.27,43.2
CL3
  Top 0.203: 105.61,43.12 U$15.MP
CL4
  Top 0.203: 111.48,41.2 111.27,41.65 U$14.MP
DUAL-FET-BATT-SWITCH
  Top 0.203: R43.2 25.87,43.7 23.76,43.68 23.26,43.61 QQ100.P$3 21.88,43.59 20.97,43.59 20.7,43.24 20.7,42.17 20.45,41.72 QQ100.P$6
DUMPFETSOURCE
  Top 0.203: Q10.2 128.1,21.9 | 128.12,21.9 130.14,21.9 133.13,26.5 134.76,27.97 137.08,28.97 JP4.3 139.81,30.16 139.83,35.38 138.87,36.17 R31.2
  Top 0.406: 128.8,23.19 R57.1 | 128.1,21.9 128.12,21.9
  Top 0.61: 128.1,21.9 128.8,23.19
GND  (via drill 0.6, 0.9)  (122 unrouted)
  Top 0.203: C1.2 76,15.63 | U1.63 66.84,16.56 v66.84,17.36 66.89,17.41 65.67,17.39 65.34,17.09 U1.60 | U1.18 66.89,26.11 v67.33,25.69 | C12.2 70.97,35.09 | 69.81,23.46 U1.12 68.14,23.42 v67.37,23.15
  Bottom 0.203: 65.38,18.74 66.44,18.46 C21.2 | 65.38,18.74 62.68,18.74 | 65.38,18.74 65.54,18.36 66.69,17.21 v66.84,17.36 | 63.74,25.16 63.54,25.16 C3.2 63.34,26.06 | v67.33,25.69 67.68,25.68 v67.37,23.15
  Bottom 0.406: CP3.2 60.74,23.36
  other vias: 84.72,34.47 58.14,11.72 60.19,4.31 56.6,11.35 39.99,2.14 30.68,4.03 44.26,6.68 90.25,7.61 100.14,7.36 92.99,12.15 68.13,37.03 69.29,34.79 137.96,43.37 130.46,43.51 122.89,43.51 115.25,43.47 54.48,38.33 39.49,36.38 46.02,24.43 107.99,43.62 100.02,43.26 97.52,43.28 91.99,37.76 30.91,37.75 34.83,37.39 35.7,33.25 30.88,28.47 25.14,23.54 28.85,23.44 17.55,26.96 12.46,20.6 52.36,39.51 54.3,30.51 46.58,25.86 37.72,42.15 39.91,42.18 42.1,42.18 86.81,8.64 85.11,8.32 90.02,16.29 81.04,25.4 86.94,22.45 84.2,18.16 89.64,13.59 89.92,42.85 92.31,42.88 90.75,38.65 92.46,39.3 92.24,17.38 82.37,16.93 79.3,31.16 84.06,21.81 81.04,22.85 81.18,18.95 75.1,14.47 54.39,32.94 57.63,34.53 59.02,42.87 50.01,40.2 47.34,39.84 55.87,41.3 49.07,36.46 49,29.97 69.23,39.01 46.05,43.04 73.27,32.31 134.74,25.88 132.51,22.2 130.95,27.19 129.87,30.59
  pour Bottom (rank 4): 14.08,46.36 61.96,46.69 90.08,23.86 104.96,23.64 105.09,19.21 92.02,13.78 88.51,7.18 87.62,1.67 86.04,-0.54 9.97,-0.65 -0.9,12.17 -1.13,32.93
  pour Top (rank 4): -1.22,33.52 -1.03,10.04 10.23,-0.57 83.72,-0.95 91.99,14.68 105.51,18.91 105.44,23.29 91.99,21.63 62.89,46.09 14.46,46.47 13.15,44.04
JP12-FETDRAIN-RC  (via drill 0.9)
  Top 0.203: 125.99,21.01 Q10.3 125.95,20.09 125.95,18.98 126.11,18.87 126.31,18.82 | R37.1 138.3,16.12 137.59,16.33 134.93,16.33 134.32,15.69 132.84,15.92 129.68,17.77 128.66,18.83 126.31,18.82 | JP4.2 137.36,31.03 | 126.31,18.82 126.31,18.43 R54.2
  Top 0.406: 131.54,33.12 v131.35,33.3 | v132.12,31.19 132.08,31.18
  Top 0.61: 125.99,21.01 126.36,25.57 127.82,27.88 133.95,30.15
  pour Top: 131.05,33.49 133.44,34.01 134.46,33.99 135.76,32.74 138.41,31.64 138.44,30.93 132.28,29.51 130.88,29.24 131.24,31.97
JTCK  (via drill 0.6)
  Top 0.203: U1.49 59.87,15.37 59.85,14.04 58.33,13.03 56.9,12.58 v56.13,12.54 | v52.04,37.82 51.98,30.75 v51.17,28.52 | v49.56,11.02 48.98,11.69 48.97,14.79 49,18.72 49.09,19.07 v49.33,20.18
  Bottom 0.203: 66.92,39.3 65.95,38.67 64.98,38.54 60.26,37.51 58.58,37.8 57,39.49 53.99,39.54 v52.04,37.82 | v51.17,28.52 49.12,27.27 49.38,22.55 49.33,21.51 49.3,21.06 49.33,20.66 v49.33,20.18 | v49.56,11.02 v56.13,12.54
JTMS  (via drill 0.6)
  Top 0.203: U1.46 55.6,18.94 v54.78,17.99 | v52.99,22.41 51.16,22.58 50.05,23.08 48.88,25.07 48.99,28.37 50.17,30.08 v50.33,38.16
  Bottom 0.203: v54.78,17.99 54.56,20.61 53.82,21.36 v52.99,22.41 | v50.33,38.16 51.29,40.59 52.52,40.85 57.2,40.05 58.96,38.41 60.41,38.24 64.81,38.99 65.78,41.13
LED1-A  (via drill 0.6)
  Top 0.203: v73.07,15.28 LED1.A
  Bottom 0.203: v73.07,15.28 73.09,14.05 72.26,13.99 R59.2
N$1  (via drill 0.6)
  Top 0.203: U1.37 56.45,23.44 53.97,25.76 52.69,26.8 52.39,27.6 52.7,28.47 53.28,29.04 53.44,36.38 55.5,36.85 58.23,36.83 v59.42,39.88 | v60.74,42.59 61.9,43.32 77.11,43.15 78.43,41.18
  Bottom 0.203: v59.42,39.88 v60.74,42.59
NRST  (via drill 0.6)
  Top 0.203: v73.01,20.44 71.3,20.92 U1.7 | v83.99,30.12 v80.88,33.19 | v76.64,12.27 v79.24,12.35
  Bottom 0.203: v73.01,20.44 74.06,20.38 77.08,13.25 76.93,12.71 v76.64,12.27 | 72.13,37.17 72.19,35.14 73.81,33.96 75.72,33.84 v80.88,33.19 | v83.99,30.12 83.63,24.54 82.48,22.22 82.5,18.57 84.25,16.33 84.29,15.35 R61.1 84.93,14.46 SW1.P$1 | SW1.P$2 79.95,13.61 | SW1.P$2 SW1.P$1 | SW1.P$2 80.03,13.61 v79.24,12.35 | SW1.P$1
PA0-PUSHBUTTON  (via drill 0.6)
  Top 0.203: U1.14 70.69,24.43 71.63,25.92 74.07,27.32 | 74.07,27.32 v74.07,27.41 | QQ100.P$1 22.93,41.74 24.11,40.9 27.83,40.88 31.13,42.08 JP11.1 | 74.07,27.32 74.18,27.39 75.35,27.69 80.02,27.12 89.22,23.37 93.86,17.4 88.44,7.96 87.31,5.24 87.3,1.6 85.74,0.6 61.39,0.68 v60.03,1.5
  Bottom 0.203: 72.82,28.66 R32.2 | JP11.1 26.78,44.67 10.45,44.86 0.82,36.48 0.71,8.48 9.59,0.95 56.89,1.12 58.83,1.17 v60.03,1.5
  Bottom 0.406: v74.07,27.41 72.86,28.01 72.82,28.66
PA1-DUMPFETGATE
  Top 0.203: U1.15 70.09,24.93 70.42,24.95 71.11,26.2 73.71,28.32 74.57,28.26 80.2,27.59 89.55,23.75 94.43,17.49 88.98,7.84 89.83,5.19 89.86,1.98 93.09,0.69 138.9,0.72 139.43,1.32 139.47,11.23 139.47,12.33 139.39,13.41 | 139.39,13.41 139.46,17.12 137.97,17.75 R38.1 C17.1 135.57,17.9 134.75,20.04 133.1,20.46 128.02,20.04 Q10.1 | R55.1 136.6,13.38 137.43,13.4 R37.2 139.12,13.4 139.39,13.41
PA2|WDT  (via drill 0.6)
  Top 0.203: U1.16 70.12,25.44 70.89,26.67 73.5,28.78 74.2,28.72 80.29,28.07 89.9,24.19 94.63,18.17 v96.34,17.68 | v97.92,20.11 100.59,21.4
  Bottom 0.203: v97.92,20.11 97.14,19.6 v96.34,17.68
PA3-DUMP-CURRENT  (via drill 0.6)
  Top 0.203: U1.17 67.68,27.38 v68.14,27.27 | v70.63,32.68 72.48,33.18 72.81,34.14 v73.04,36.86 | R31.1 139.43,38.87 139.41,39.47 v139.09,39.7
  Bottom 0.203: v68.14,27.27 69.11,28.22 70.01,31.56 v70.63,32.68 | v73.04,36.86 74.61,39.37 74.61,42.84 76.1,44.76 138.29,44.76 139.74,43.83 139.7,40.39 v139.09,39.7
PA8-T1CH1-FANGATE  (via drill 0.6)
  Top 0.203: U1.41 55.12,21.44 v54.54,21.86 | v59.24,10.46 58.22,10.11 56.17,10.15 54.8,11.26 53.63,14.44 54.23,15.42 54.7,15.81 55.06,16.44 55.33,17.15 v56.26,17.61
  Bottom 0.203: v54.54,21.86 56.06,18.21 56.15,17.92 v56.26,17.61 | v59.24,10.46 60.47,7.18 71.53,6.02 73.44,3.64
PA9-USART1-TX  (via drill 0.6)
  Top 0.203: v52.2,16.81 51.8,16.53 51.79,9.92 53.23,7.77 78.3,7.74 78.3,7.73 80.31,7.73 | v51.85,21.5 54.76,20.93 U1.42
  Bottom 0.203: v52.2,16.81 52.03,18.15 v51.85,21.5
PA10-USART1-RX  (via drill 0.6)
  Top 0.203: v52.94,18.01 53.19,16.56 52.33,15.74 52.31,9.97 53.65,8.23 80.36,8.26 81.13,8.31 82.9,8.31 | v52.94,20.43 U1.43
  Bottom 0.203: v52.94,18.01 52.82,18.93 v52.94,20.43
PA11_CANRXD  (via drill 0.6)
  Top 0.203: 68.44,7.24 52.91,7.23 51.29,9.71 51.33,16.06 51.3,16.87 51.3,17.83 v51.21,18.13 | v51.09,20.42 52.19,19.65 52.75,19.61 53.99,19.48 55.21,19.93 58.02,19.92 U1.44
  Bottom 0.203: v51.21,18.13 v51.09,20.42
PA12_CANTX
  Top 0.203: 66.76,6.71 52.52,6.77 50.77,9.58 50.83,16.06 50.83,16.77 50.79,17.27 50.39,17.86 50.36,18.32 50.47,18.7 50.83,18.99 52.13,18.92 54.05,18.89 55.45,19.42 U1.45
PB0  (via drill 0.6)
  Top 0.203: 42.29,27.98 v42.33,29.1 | 42.29,27.98 41.26,28 R40.2 41.41,28 41.45,26.6 36.29,26.77 v34.47,27.25 | 42.29,27.98 42.32,27.95 C20.1 | JP10.2 32.07,21.55 v32.59,22.98 | U1.26 62.86,28.79 62.06,29.93 v61.55,31.05
  Bottom 0.203: v61.55,31.05 60.48,31.86 58.74,33.06 58.15,33.44 53.53,33.96 52.89,33.7 46.56,29.69 v42.33,29.1 | v32.59,22.98 v34.47,27.25
PB1-T3C4-FANTACH  (via drill 0.6)
  Top 0.203: v61.63,33.76 60.25,31.04 60.87,30.31 61.4,29.76 61.46,28.58 62.36,28.36 62.37,27.4 U1.27
  Bottom 0.203: 70.02,38.06 65.65,37.95 64.33,37.34 62.69,35.51 v61.63,33.76
PB5-CAN2-RX
  Top 0.203: U1.57 63.86,14.95 64.39,12.96 U$18.MP
PB6-CAN2-TX
  Top 0.203: U1.58 64.36,15.19 65.2,13.73 66.18,12.15 U$17.MP
PB7
  Top 0.203: U1.59 64.85,15.29 65.74,13.84 67.09,12.7 67.36,11.78 67.89,10.79 U$23.MP
PB8-I2C2-SDA  (via drill 0.6)
  Top 0.203: U1.61 65.87,14.89 67.68,12.78 v68.53,12.05 | v70.56,10.78 72.89,10.51 75.85,9.96 83.26,9.93 88.98,10.09 91.88,14.95 87.59,14.91 JP3.3 87.64,14.91 R23.2
  Bottom 0.203: v68.53,12.05 v70.56,10.78
PB9-I2C1-SCL  (via drill 0.6)
  Top 0.203: U1.62 66.37,15.12 v68.73,13.93 | v72.65,11.56 76.46,10.96 82,11.03 84.38,11.09 84.68,12 R24.2 87.64,12.36 JP3.4
  Bottom 0.203: v68.73,13.93 70.29,12.26 v72.65,11.56
PB11-I2C2-SDA|VCAP1  (via drill 0.6)
  Top 0.203: U1.30 60.86,29.17 60.7,29.65 v58.78,30.31
  Bottom 0.203: v58.78,30.31 58.29,30.46 57.99,30.55 CP2.1
PB12-SPI2-NSS
  Top 0.203: U1.33 57.91,25.8 57.52,27.39 56.91,28.27 U$19.MP
PB14-SPI2-MISO
  Top 0.203: U1.35 56.85,24.44 56.61,24.57 56.14,25.69 U$21.MP
PB-13-SPI2-SCK
  Top 0.203: U1.34 56.98,24.93 56.68,26.91 56.18,27.49 55.66,28.12 U$20.MP
PB-15-SPI2-MOSI
  Top 0.203: U1.36 56.8,23.93 56.26,24.22 55.02,25.67 U$22.MP
PC0-15VDIVIDED-IN10  (via drill 0.6)
  Top 0.203: U1.8 70.77,21.44 72.14,21.25 v73.33,21.96
  Bottom 0.203: v73.33,21.96 73.43,21.83 74.43,20.81 77.62,13.05 78.1,8.61 80.1,7.65 87.96,5.82 88.65,3.54
PC1-BATDIVIDED-IN11  (via drill 0.6)
  Top 0.203: U1.9 70.78,21.93 v71.65,22.21
  Bottom 0.203: v71.65,22.21 72.85,22.71 73.29,22.86 73.69,22.78 74.05,22.59 74.56,21.79 78.16,13.14 78.63,8.93 80.24,8.06 86.89,6.6 89.56,5.87 91.18,3.61
PC2-IN12-5V-DIVIDED  (via drill 0.6)
  Top 0.203: U1.10 70.6,22.44 70.99,23.03 v73.38,23.77
  Bottom 0.203: R44.2 R45.1 78.75,27.09 78.64,26.36 77.65,25.63 v73.38,23.77
PC3-15V-OR-DIVIDED-IN13  (via drill 0.6)
  Top 0.203: U1.11 70.18,22.91 70.37,23.4 70.95,23.51 72.72,24.6 73.12,24.89 73.13,24.89 v74.11,25.75 | 24.04,38.73 R48.1 | R47.2 24.04,38.73 | 24.04,38.73 24.06,37.66 28.03,37.7 31.27,35.08 v33.41,35.33 | v36.78,35.23 40.17,39.37 48.8,41.27 51.76,42.04 53.4,42 v56.49,38.09 | v60.98,35.48 62.06,35.26 63.94,32.55 66.48,32.53 69.51,31.41 76.89,30.79 v77.74,31.44
  Bottom 0.203: v33.41,35.33 v36.78,35.23 | v56.49,38.09 v60.98,35.48 | v77.74,31.44 76.22,26.33 v74.11,25.75
PC4-HEADER  (via drill 0.6)
  Top 0.203: R41.2 45.41,32.81 44.02,32.32 43.97,31.19 C19.1 41.34,31.26 R39.2 41.57,31.24 41.47,30.43 41.08,29.95 37.65,29.92 v36.58,29.11 | JP10.3 v34.44,22.53
  Bottom 0.203: v34.44,22.53 v36.58,29.11
PC4-IN14  (via drill 0.6)
  Top 0.203: U1.24 63.86,29.51 v64.27,31.61 | v42.66,32.98 42.68,34 | 42.68,34 42.69,34.01 R41.1 | R42.2 41.41,33.99 42.68,34
  Bottom 0.203: v64.27,31.61 63.22,32.31 61.16,32.42 59.99,33.65 57.45,36.3 54.38,37.06 v42.66,32.98
PC5-7VDIVIDED-IN15  (via drill 0.6)
  Top 0.203: U1.25 63.36,29.38 v63.02,30.54 | 26.75,20.42 v26.82,22.02 | R49.2 26.19,20.45 26.75,20.42 | R51.1 27.57,20.51 26.75,20.42
  Bottom 0.203: v63.02,30.54 61.89,30.07 60.58,30.12 58.65,32.2 55.18,32.1 53.42,31.48 45.76,26.59 37.36,20.75 28.27,22.08 v26.82,22.02
PC7-T3C2-MCP1416-INPUT  (via drill 0.6)
  Top 0.203: U1.38 56.14,22.94 55.44,23.44 v53.84,24.53 | v49.85,12.25 v49.87,16.8 | v53.18,12.81 52.88,10.11 54,8.67 72.08,8.7 v73.13,9.46
  Bottom 0.203: v78.71,6.68 76.29,8.14 74.52,9.01 v73.13,9.46 | v53.84,24.53 52.95,25.36 52.05,25.42 50.54,24.82 50.27,24.2 50.2,20.79 50.32,19.35 v49.87,16.8 | v49.85,12.25 v53.18,12.81
PC8-SDIO_D0
  Top 0.203: U1.39 55.96,22.45 55.3,22.98 53.16,23.83 52.89,24.37 52.08,25.66 U$27.MP
PC9-SDIO_D1
  Top 0.203: U1.40 55.67,21.93 55.09,22.58 53.31,23.29 U$24.MP
PC10-LED2  (via drill 0.6, 0.8)
  Top 0.203: v72.88,6.77 76.27,6.39 | v60.04,12.46 60.9,13.02 60.89,13.81 60.86,15 U1.51
  Bottom 0.203: v72.88,6.77 61.23,8.24 60.29,10.17 v60.04,12.46
PC11-LED1  (via drill 0.8)
  Top 0.203: v61.69,11.52 61.37,14.38 61.37,15.94 U1.52
  Bottom 0.203: 75.55,6.87 73.39,7.96 69.95,7.95 62.97,8.91 62.18,9.25 61.52,10.11 61.48,10.53 v61.69,11.52
PC12-SDIO_CK|I2C2-SDA
  Top 0.203: U1.53 61.87,14.72 62.18,12.5 63.15,11.25 63.18,10.17 U$25.MP
PC13-LED1
  Top 0.203: U1.2 71.41,18.44 72.93,18.38 LED1.C
PD0_OSC_IN_XTAL
  Top 0.203: U1.5 70.98,19.93 72.57,18.92 73.86,18.91 74.38,19.04 74.66,19.52 75.63,19.53 R52.1 C1.1 76,17.73 77.85,17.75 Q1.2
PD1_OSC_OUT
  Top 0.203: U1.6 71.22,20.43 72.82,19.46 73.71,19.5 74.8,21.22 75.64,21.25 R52.2 75.6,22.33 C2.1 76,22.83 77.94,22.83 Q1.1
PD2-SDIO_CMD
  Top 0.203: U1.54 62.35,14.89 62.72,12.61 64.48,11.24 65.44,10.02 U$26.MP
S18  (via drill 0.6)
  Top 0.203: v97.36,11.36 101.03,12.46 107.35,14.38
  Bottom 0.203: JP2.14 96.17,5.93 v97.36,11.36
VBAT  (via drill 0.6)
  Top 0.203: v53.87,10.26 54.1,9.54 54.28,9.11 68.77,9.13 69.48,10.46 69.7,13.49 69.66,15.19 70.78,16.36 70.19,17.93 69.35,17.94 U1.1
  Bottom 0.203: C13.1 47.36,13.71 48.22,9.96 49.3,9.99 50.47,9.5 51.39,8.49 51.38,8.5 | 52.78,3.41 52.53,3.55 50.77,3.56 50.73,7.94 51.38,8.5 | v53.87,10.26 53.53,10.33 51.38,8.5
  Bottom 0.305: C15.1 52.52,3.78 52.78,3.41 54.17,3.42 | 54.17,3.42 U$4.5 | 54.17,3.42 54.25,3.72 | 38.68,12.78 38.69,12.77
  Bottom 0.406: R30.1 38.68,12.78 40.83,13.75 42.36,13.69 C14.1 45.71,13.77 C13.1
VBAT-DIODE-RES
  Bottom 0.406: D3.C R30.2
VCC  (via drill 0.6, 0.9)  (28 unrouted)
  Top 0.203: 66.34,28.5 v67.85,28.9 67.82,28.86 68.45,28.65 v69.74,27.17 | v66.45,21.96 v66.44,21.96 66.45,21.92 | 67.37,15.42 67.37,15.2 | 67.37,15.42 67.38,15.92 | v59.85,28.74 v59.86,28.74 U1.32 | v61.78,19.56 62.01,19.34 | v68.86,16.68 68.8,16.72 | v33.12,31.05 32.38,26.75 33.43,25.82 38.25,24.92 | v32.68,37.15 33.49,39.9 33.6,42.09 JP11.2 | 67.37,15.42 67.31,15.42 U1.64 | v74.11,12.96 80.19,14.24 v81,15.39
  Bottom 0.203: 65.03,25.09 65.24,25.16 | 65.03,23.89 C5.1 65.11,23.37 | 66.44,20.86 C21.1 67.34,19.86 | 60.46,29.07 CP8.1 | BEAD.1 70.59,25.04 | v33.12,31.05 31.79,34.67 v32.68,37.15 | 69.86,26.78 69.86,27.09 69.78,27.06 v69.74,27.17 69.85,26.85 69.88,27.23 | v68.86,16.68 68.91,16.64 R59.1 70.76,12.99 v74.11,12.96 | 82.55,15.42 R61.2 82.54,15.3 v81,15.39
  Bottom 0.406: 65.03,23.89 65.03,25.09 | 65.24,25.16 C3.1 | v66.44,21.96 65.11,23.37 | 66.44,20.86 v66.44,21.96 | C4.1 65.77,21.31 66.39,21.9 v66.44,21.96 | v67.85,28.9 66.64,29.31 | v59.85,28.74 60.46,29.07 | C7.1 v61.78,19.56 | v68.86,16.68 C8.1 | 69.86,26.78 70.55,25.78 70.59,25.04
  other vias: 64.14,17.84 37.62,19.39 56.32,16.06 57.4,16.79 54.87,13.91 58.23,14.13 42.92,17.66 40.29,18.69 42.57,15.7 58.24,15.72 47.46,18.15 47.13,16 45.19,16.91 56.96,14.97 55.43,15.1 56.38,13.86
  pour Top: 57.09,26.6 59.46,28.18 68.21,29.77 70.88,27.58 70.85,25.22 70.65,16.99 67.18,14.54 59.12,14.5 57.84,17.06 57.76,26.18
  pour Bottom: 17.85,12.97 18.43,13.39 27.44,13.48 31.5,19.15 35.69,23.15 47.46,22.7 50.85,19.48 56.52,18.68 58.74,16.05 58.77,13.13 45.14,12.15 41.4,11.96 27.66,5.39 24.53,5.69 18.14,8.43
  pour Top: 58.77,12.98 59.5,14.38 59.5,28.34 55.33,26.95 49.72,20.3 39.52,25.22 36.95,25.28 32.41,15.77 17.72,13.69 17.77,8.41 27.28,3.95 38.29,8.17 46.68,9.51 53.99,12.1
VDDA  (via drill 0.6)
  Top 0.203: U1.13 70.85,23.94 v72.22,25.27
  Bottom 0.203: BEAD.2 69.21,24.2 69.35,23.42 C18.1 69.34,23.64 71.32,23.66 v72.22,25.27
VSS_1-VCAP_1  (via drill 0.6)
  Top 0.203: v60.34,26.06 60.34,26.86 U1.31
  Bottom 0.203: CP3.1 60.34,25.06
  Bottom 0.406: 60.34,25.06 v60.34,26.06
VSS_2  (via drill 0.6)
  Top 0.203: v59.75,18.4 59.24,18.45 58.44,18.46 U1.47
  Bottom 0.203: 60.14,18.46 v59.75,18.4
  Bottom 0.406: CP1.1 60.83,18.05 60.14,18.46

### Text on the board
bNames: 5
tValues: 3.3V | DIGITAL | +5V | 3.2v | ANALOG | 3.2